# Altium schematic sheet F28335_FanOut.SchDoc
size Letter; DocumentNumber: 9; SheetNumber: 9; SheetTotal: 9
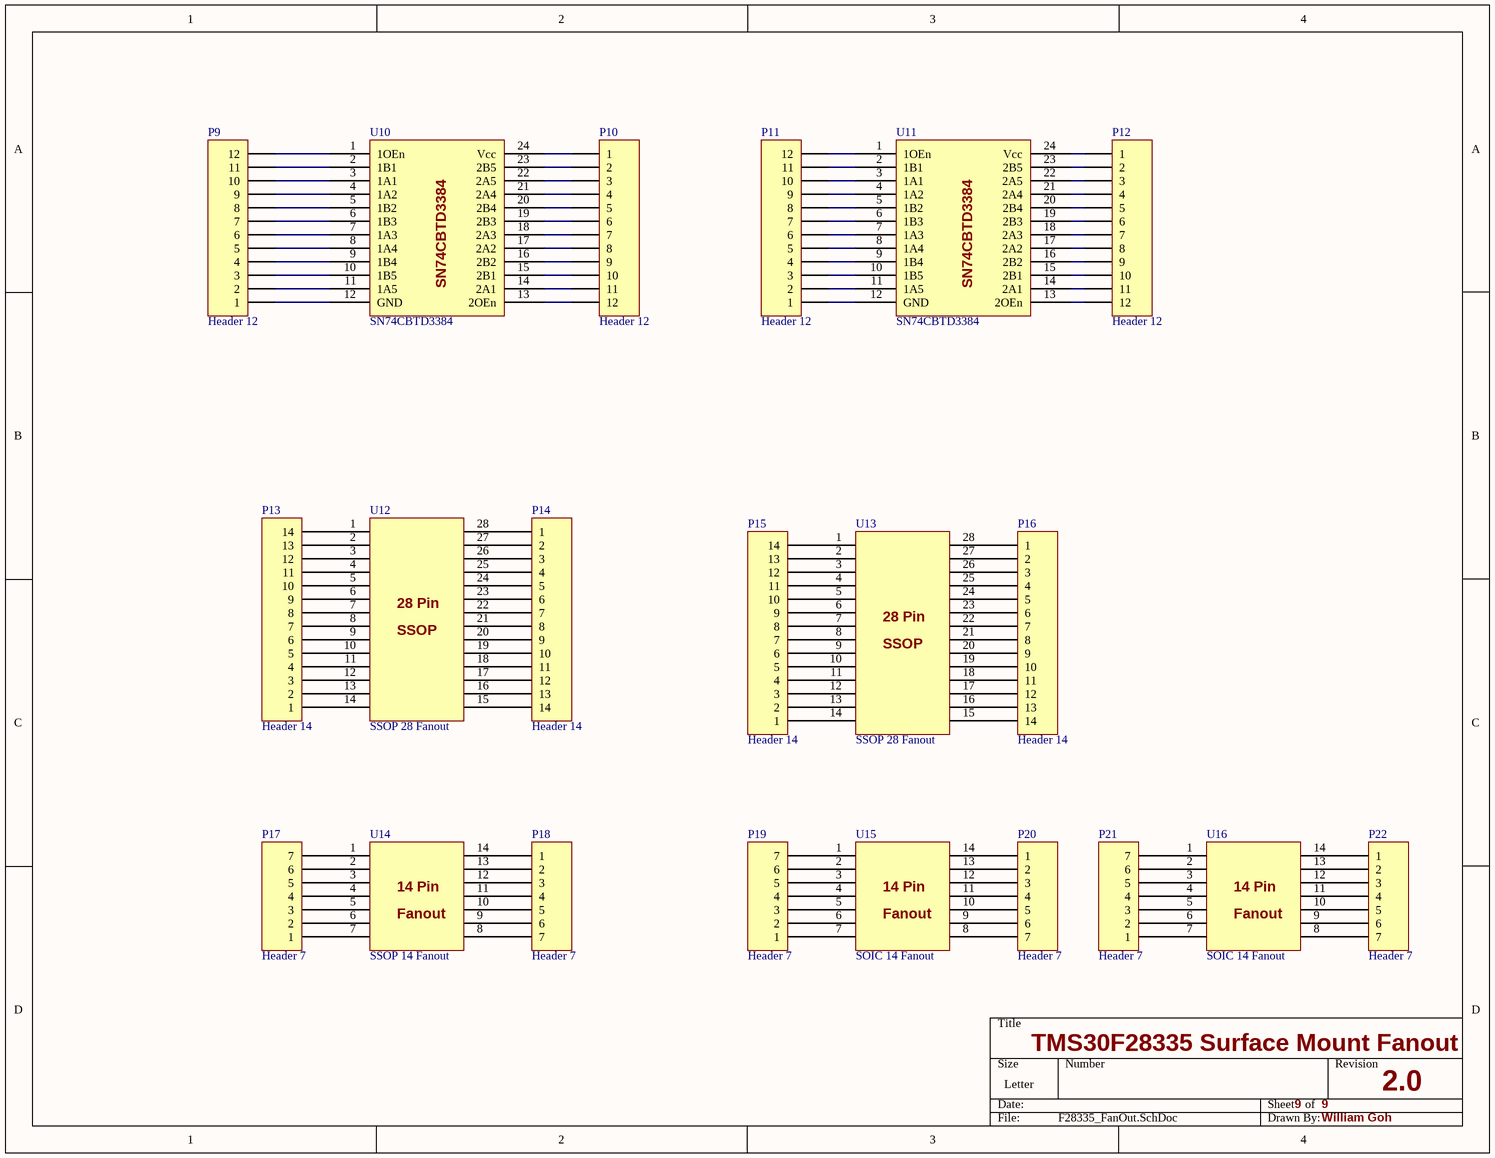
[diagram p0: F28335_FanOut.SchDoc]

## Parts
P9  Header 12  [HDR1X12]
P10  Header 12  [HDR1X12]
P11  Header 12  [HDR1X12]
P12  Header 12  [HDR1X12]
P13  Header 14  [HDR1X14]
P14  Header 14  [HDR1X14]
P15  Header 14  [HDR1X14]
P16  Header 14  [HDR1X14]
P17  Header 7  [HDR1X7]
P18  Header 7  [HDR1X7]
P19  Header 7  [HDR1X7]
P20  Header 7  [HDR1X7]
P21  Header 7  [HDR1X7]
P22  Header 7  [HDR1X7]
U10  SN74CBTD3384  [DW-24]
U11  SN74CBTD3384  [DW-24]
U12  SSOP 28 Fanout  [SSOP-28 Fan out]
U13  SSOP 28 Fanout  [SSOP-28 Fan out]
U14  SSOP 14 Fanout  [SSOP-14 Fan out]
U15  SOIC 14 Fanout  [SOIC-14 Fan out]
U16  SOIC 14 Fanout  [SOIC-14 Fan out]

## Nets
NetP9_1: P9.1 U10.12(GND)
NetP9_2: P9.2 U10.11(1A5)
NetP9_3: P9.3 U10.10(1B5)
NetP9_4: P9.4 U10.9(1B4)
NetP9_5: P9.5 U10.8(1A4)
NetP9_6: P9.6 U10.7(1A3)
NetP9_7: P9.7 U10.6(1B3)
NetP9_8: P9.8 U10.5(1B2)
NetP9_9: P9.9 U10.4(1A2)
NetP9_10: P9.10 U10.3(1A1)
NetP9_11: P9.11 U10.2(1B1)
NetP9_12: P9.12 U10.1(1OEn)
NetP10_1: P10.1 U10.24(Vcc)
NetP10_2: P10.2 U10.23(2B5)
NetP10_3: P10.3 U10.22(2A5)
NetP10_4: P10.4 U10.21(2A4)
NetP10_5: P10.5 U10.20(2B4)
NetP10_6: P10.6 U10.19(2B3)
NetP10_7: P10.7 U10.18(2A3)
NetP10_8: P10.8 U10.17(2A2)
NetP10_9: P10.9 U10.16(2B2)
NetP10_10: P10.10 U10.15(2B1)
NetP10_11: P10.11 U10.14(2A1)
NetP10_12: P10.12 U10.13(2OEn)
NetP11_1: P11.1 U11.12(GND)
NetP11_2: P11.2 U11.11(1A5)
NetP11_3: P11.3 U11.10(1B5)
NetP11_4: P11.4 U11.9(1B4)
NetP11_5: P11.5 U11.8(1A4)
NetP11_6: P11.6 U11.7(1A3)
NetP11_7: P11.7 U11.6(1B3)
NetP11_8: P11.8 U11.5(1B2)
NetP11_9: P11.9 U11.4(1A2)
NetP11_10: P11.10 U11.3(1A1)
NetP11_11: P11.11 U11.2(1B1)
NetP11_12: P11.12 U11.1(1OEn)
NetP12_1: P12.1 U11.24(Vcc)
NetP12_2: P12.2 U11.23(2B5)
NetP12_3: P12.3 U11.22(2A5)
NetP12_4: P12.4 U11.21(2A4)
NetP12_5: P12.5 U11.20(2B4)
NetP12_6: P12.6 U11.19(2B3)
NetP12_7: P12.7 U11.18(2A3)
NetP12_8: P12.8 U11.17(2A2)
NetP12_9: P12.9 U11.16(2B2)
NetP12_10: P12.10 U11.15(2B1)
NetP12_11: P12.11 U11.14(2A1)
NetP12_12: P12.12 U11.13(2OEn)
NetP13_1: P13.1 U12.14
NetP13_2: P13.2 U12.13
NetP13_3: P13.3 U12.12
NetP13_4: P13.4 U12.11
NetP13_5: P13.5 U12.10
NetP13_6: P13.6 U12.9
NetP13_7: P13.7 U12.8
NetP13_8: P13.8 U12.7
NetP13_9: P13.9 U12.6
NetP13_10: P13.10 U12.5
NetP13_11: P13.11 U12.4
NetP13_12: P13.12 U12.3
NetP13_13: P13.13 U12.2
NetP13_14: P13.14 U12.1
NetP14_1: P14.1 U12.28
NetP14_2: P14.2 U12.27
NetP14_3: P14.3 U12.26
NetP14_4: P14.4 U12.25
NetP14_5: P14.5 U12.24
NetP14_6: P14.6 U12.23
NetP14_7: P14.7 U12.22
NetP14_8: P14.8 U12.21
NetP14_9: P14.9 U12.20
NetP14_10: P14.10 U12.19
NetP14_11: P14.11 U12.18
NetP14_12: P14.12 U12.17
NetP14_13: P14.13 U12.16
NetP14_14: P14.14 U12.15
NetP15_1: P15.1 U13.14
NetP15_2: P15.2 U13.13
NetP15_3: P15.3 U13.12
NetP15_4: P15.4 U13.11
NetP15_5: P15.5 U13.10
NetP15_6: P15.6 U13.9
NetP15_7: P15.7 U13.8
NetP15_8: P15.8 U13.7
NetP15_9: P15.9 U13.6
NetP15_10: P15.10 U13.5
NetP15_11: P15.11 U13.4
NetP15_12: P15.12 U13.3
NetP15_13: P15.13 U13.2
NetP15_14: P15.14 U13.1
NetP16_1: P16.1 U13.28
NetP16_2: P16.2 U13.27
NetP16_3: P16.3 U13.26
NetP16_4: P16.4 U13.25
NetP16_5: P16.5 U13.24
NetP16_6: P16.6 U13.23
NetP16_7: P16.7 U13.22
NetP16_8: P16.8 U13.21
NetP16_9: P16.9 U13.20
NetP16_10: P16.10 U13.19
NetP16_11: P16.11 U13.18
NetP16_12: P16.12 U13.17
NetP16_13: P16.13 U13.16
NetP16_14: P16.14 U13.15
NetP17_1: P17.1 U14.7
NetP17_2: P17.2 U14.6
NetP17_3: P17.3 U14.5
NetP17_4: P17.4 U14.4
NetP17_5: P17.5 U14.3
NetP17_6: P17.6 U14.2
NetP17_7: P17.7 U14.1
NetP18_1: P18.1 U14.14
NetP18_2: P18.2 U14.13
NetP18_3: P18.3 U14.12
NetP18_4: P18.4 U14.11
NetP18_5: P18.5 U14.10
NetP18_6: P18.6 U14.9
NetP18_7: P18.7 U14.8
NetP19_1: P19.1 U15.7
NetP19_2: P19.2 U15.6
NetP19_3: P19.3 U15.5
NetP19_4: P19.4 U15.4
NetP19_5: P19.5 U15.3
NetP19_6: P19.6 U15.2
NetP19_7: P19.7 U15.1
NetP20_1: P20.1 U15.14
NetP20_2: P20.2 U15.13
NetP20_3: P20.3 U15.12
NetP20_4: P20.4 U15.11
NetP20_5: P20.5 U15.10
NetP20_6: P20.6 U15.9
NetP20_7: P20.7 U15.8
NetP21_1: P21.1 U16.7
NetP21_2: P21.2 U16.6
NetP21_3: P21.3 U16.5
NetP21_4: P21.4 U16.4
NetP21_5: P21.5 U16.3
NetP21_6: P21.6 U16.2
NetP21_7: P21.7 U16.1
NetP22_1: P22.1 U16.14
NetP22_2: P22.2 U16.13
NetP22_3: P22.3 U16.12
NetP22_4: P22.4 U16.11
NetP22_5: P22.5 U16.10
NetP22_6: P22.6 U16.9
NetP22_7: P22.7 U16.8

## Notes on the sheet
- TMS30F28335 Surface Mount Fanout
- 2.0
- William Goh
- (in symbol SSOP 14 Fanout) 14 Pin; Fanout
- (in symbol SSOP 28 Fanout) 28 Pin; SSOP

## Library data of the parts
P9-P12 = Header 12: Header, 12-Pin; LatestRevisionDate: 17-Jul-2002; LatestRevisionNote: Re-released for DXP Platform.; Publisher: Altium Limited
P13-P16 = Header 14: Header, 14-Pin; LatestRevisionDate: 17-Jul-2002; LatestRevisionNote: Re-released for DXP Platform.; Publisher: Altium Limited
P17-P22 = Header 7: Header, 7-Pin; LatestRevisionDate: 17-Jul-2002; LatestRevisionNote: Re-released for DXP Platform.; Publisher: Altium Limited
U10 U11 = SN74CBTD3384: 10-Bit FET Bus Switches With Level Shifting
U15 U16 = SSOP 14 Fanout